# EAGLE schematic Configuration_Board (EAGLE 6.3)
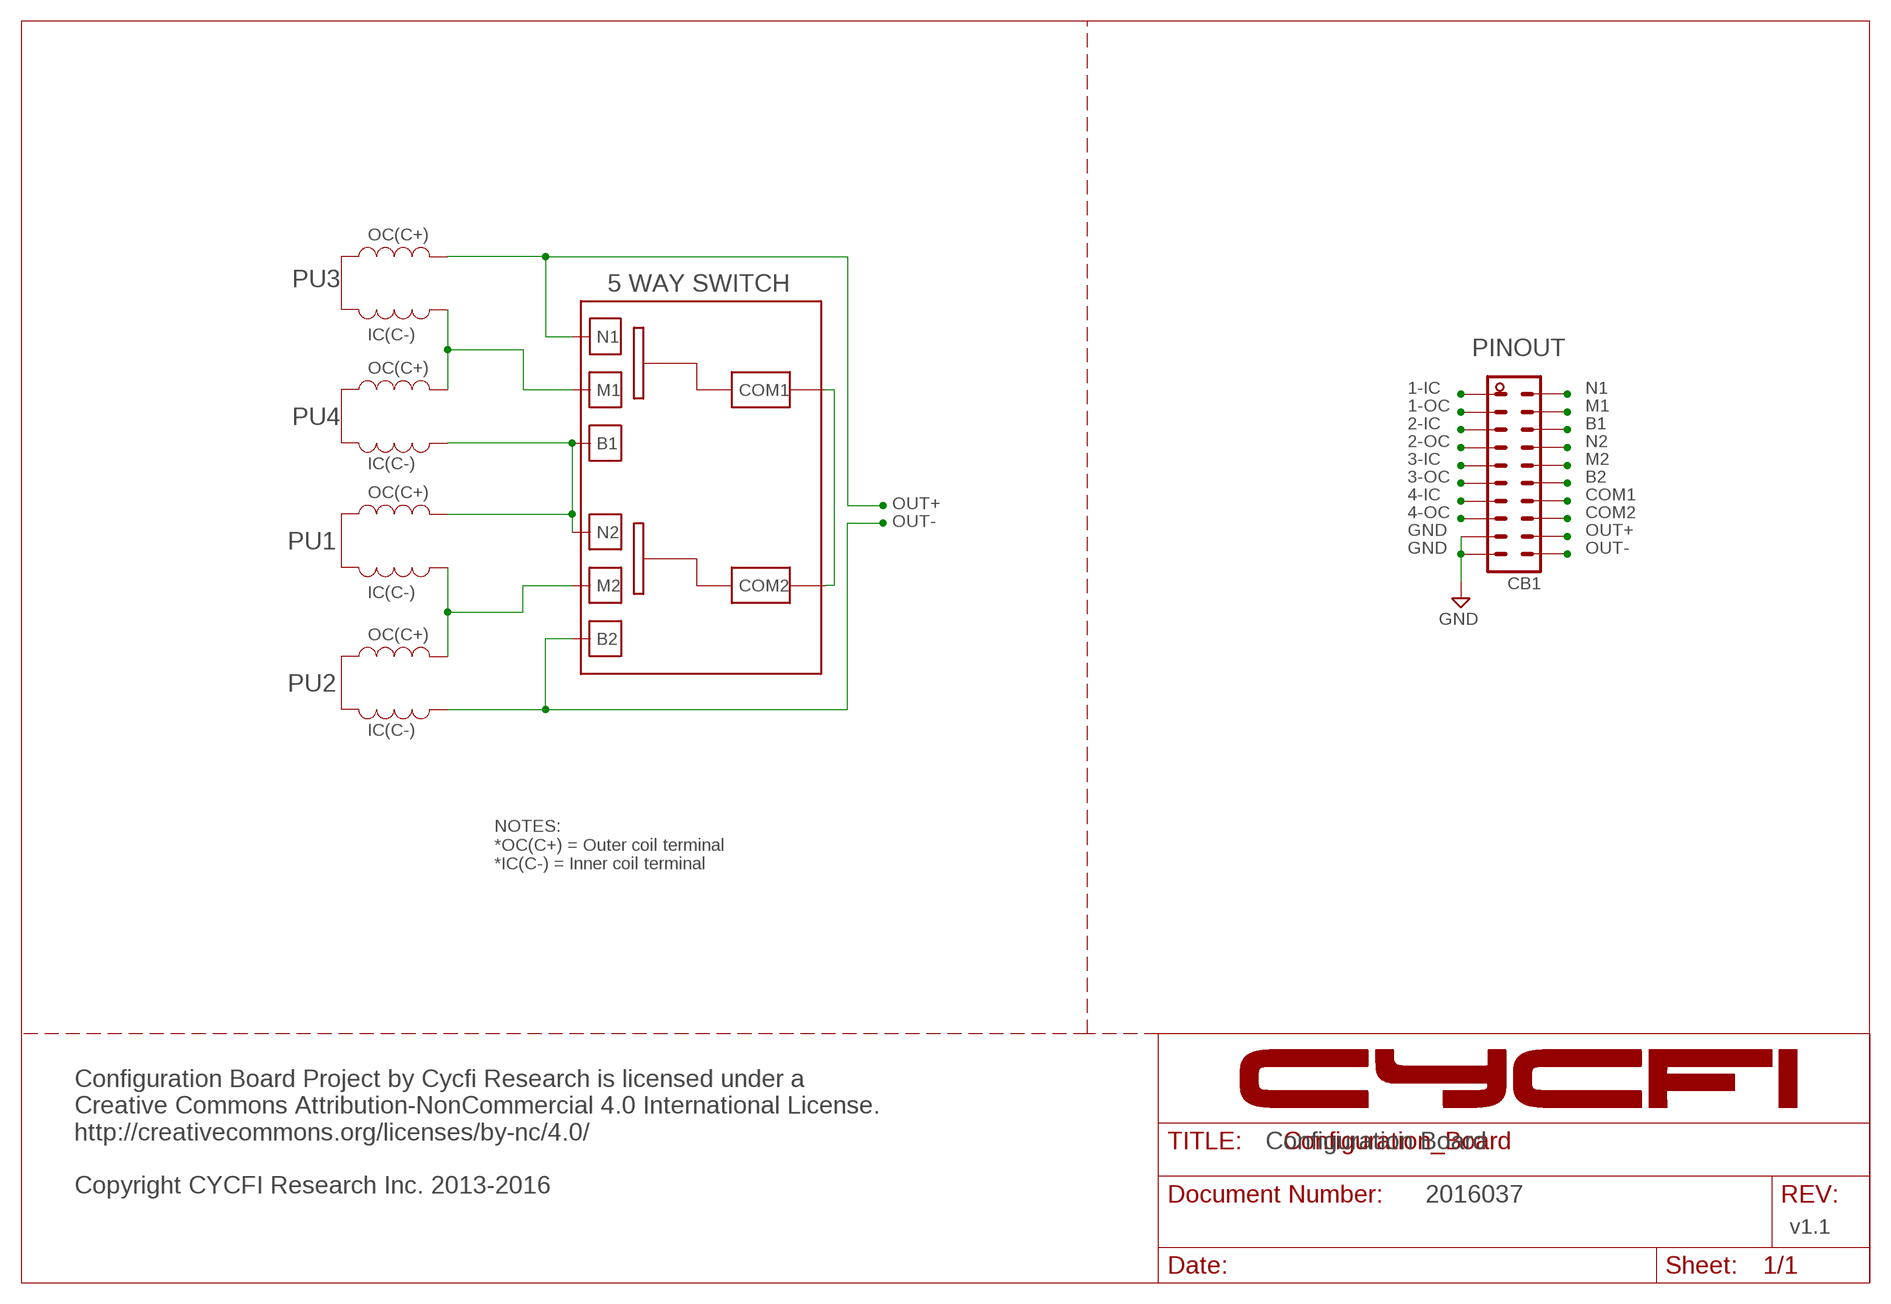
[diagram p0: schematic, sheet 1]

## Parts
CB1  CONFIGURATION_BRD_CAST  [CONFIGURATION_BRD_CAST]

## Nets
1: CB1.3-OC CB1.N1 CB1.OUT+
2: CB1.3-IC CB1.4-OC CB1.M1
3: CB1.1-OC CB1.4-IC CB1.B1 CB1.N2
4: CB1.COM1 CB1.COM2
5: CB1.1-IC CB1.2-OC CB1.M2
6: CB1.2-IC CB1.B2 CB1.OUT-
GND: CB1.GND CB1.GND1

## Notes on the sheet
- OC(C+)
- PU3 | 5 WAY SWITCH
- IC(C-) | N1
- PINOUT
- OC(C+)
- M1 | COM1 | 1-IC | N1
- 1-OC | M1
- PU4 | 2-IC | B1
- B1 | 2-OC | N2
- IC(C-) | 3-IC | M2
- 3-OC | B2
- OC(C+) | 4-IC | COM1
- OUT+
- 4-OC | COM2
- OUT-
- N2 | GND | OUT+
- PU1 | GND | OUT-
- M2 | COM2
- IC(C-)
- OC(C+) | B2
- PU2
- IC(C-)
- NOTES:
  *OC(C+) = Outer coil terminal
  *IC(C-) = Inner coil terminal
- Configuration Board
- Configuration Board Project by Cycfi Research is licensed under a 
  Creative Commons Attribution-NonCommercial 4.0 International License. 
  http://creativecommons.org/licenses/by-nc/4.0/
  
  Copyright CYCFI Research Inc. 2013-2016
- 2016037
- v1.1

## Library data of the parts
CB1 = CYCFI_Module_castellated:CONFIGURATION_BRD_CAST